# Altium schematic sheet MCU_Core.SchDoc
size A4; SheetNumber: 3; SheetTotal: 11
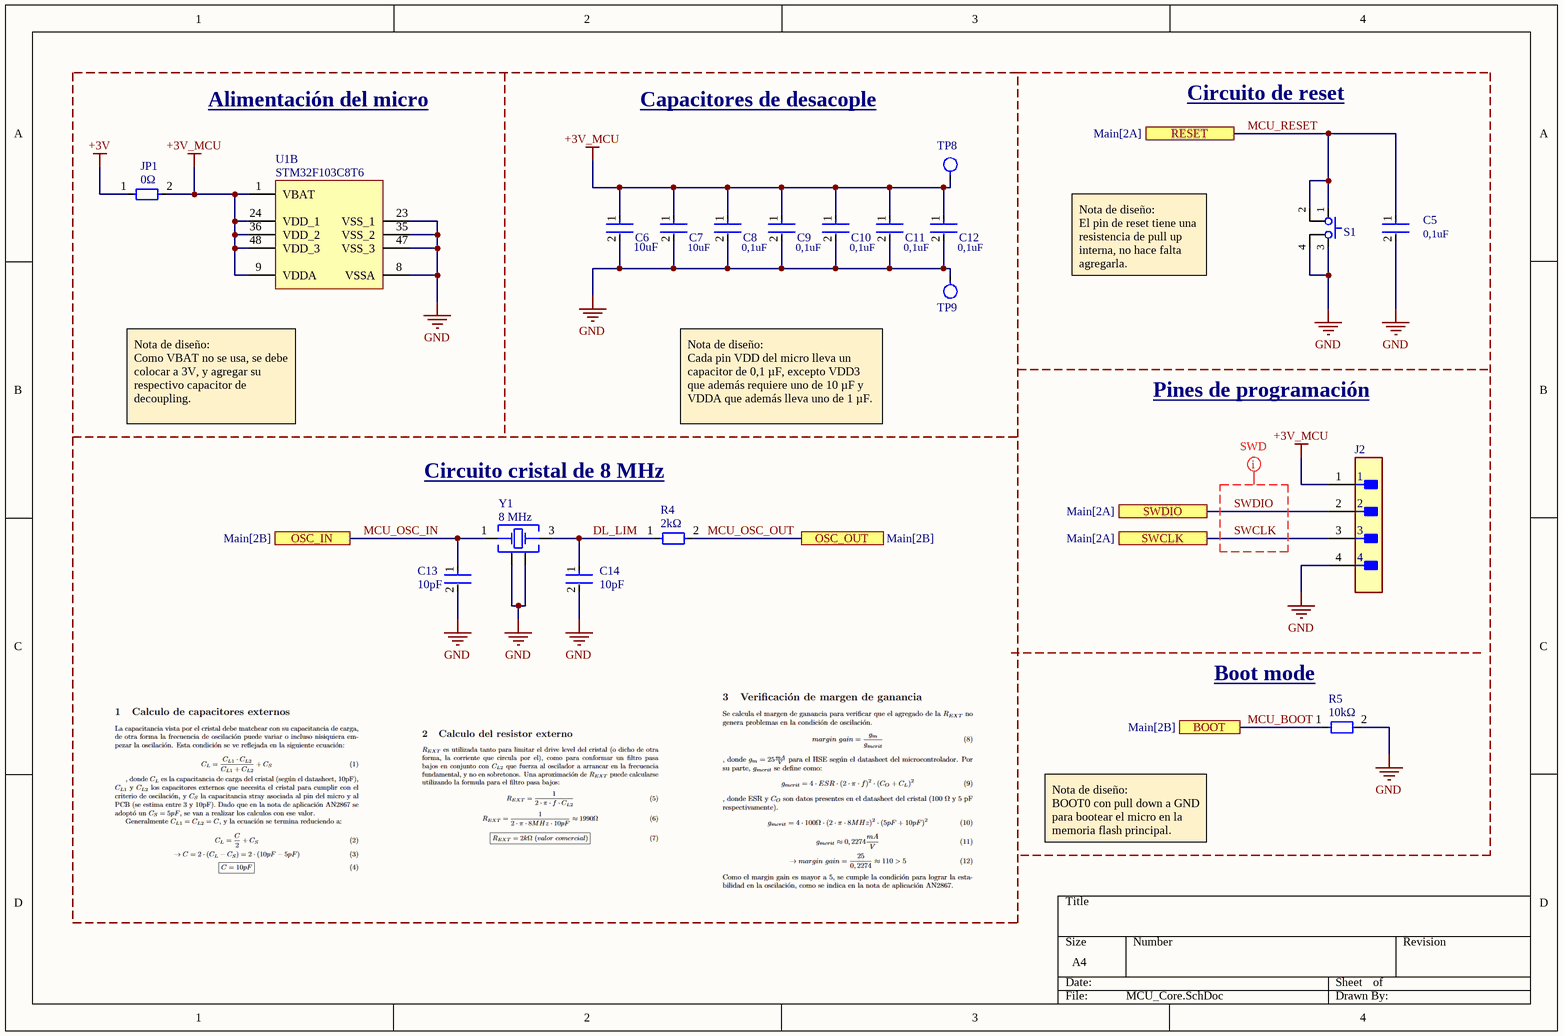
[diagram p0: MCU_Core.SchDoc]

## Parts
C5  Capacitance: 0,1uF  [CAP_0603]  (hidden comment: 0.1uF)
C6  10uF  [CAP_0603]
C7  10uF  [CAP_0603]
C8  Capacitance: 0,1uF  [CAP_0603]  (hidden comment: 0.1uF)
C9  Capacitance: 0,1uF  [CAP_0603]  (hidden comment: 0.1uF)
C10  Capacitance: 0,1uF  [CAP_0603]  (hidden comment: 0.1uF)
C11  Capacitance: 0,1uF  [CAP_0603]  (hidden comment: 0.1uF)
C12  Capacitance: 0,1uF  [CAP_0603]  (hidden comment: 0.1uF)
C13  10pF  [CAP_0603]
C14  10pF  [CAP_0603]
J2  HTSW-104-07-G-S  [FP-HTSW-104-07-G-S-MFG]  (value not drawn)
JP1  value 0Ω  [RES_0R_0603]  (hidden comment: Generic JP)  (no BOM)
R4  value 2kΩ  [RES_0603]  (hidden comment: 2k)
R5  value 10kΩ  [RES_0603]  (hidden comment: 10k)
S1  Tactile push button 5,2mm x 5,2mm  [Switch Tactile 5,2mm x 5,2mm]  (value not drawn)
TP8  Testpoint SMD  [Testpoint_SMD]  (value not drawn)  (no BOM)
TP9  Testpoint SMD  [Testpoint_SMD]  (value not drawn)  (no BOM)
U1  STM32F103C8T6  [STM-LQFP48_L]  (part B of 2)
Y1  Frequency: 8 MHz  [SMD5032-4P]  (hidden comment: Crystal SMD 4-P)

## Ports
BOOT (see Main[2B]), OSC_IN (see Main[2B]), OSC_OUT (see Main[2B]), RESET (see Main[2A]), SWCLK (see Main[2A]), SWDIO (see Main[2A])

## Nets
+3V: JP1.1
+3V_MCU: C6.1 C7.1 C8.1 C9.1 C10.1 C11.1 C12.1 J2.1 JP1.2 TP8.1 U1.1(VBAT) U1.9(VDDA) U1.24(VDD_1) U1.36(VDD_2) U1.48(VDD_3)
GND: C5.2 C6.2 C7.2 C8.2 C9.2 C10.2 C11.2 C12.2 C13.2 C14.2 J2.4 R5.2 S1.3 S1.4 TP9.1 U1.8(VSSA) U1.23(VSS_1) U1.35(VSS_2) U1.47(VSS_3) Y1.2(GND_&_Lid) Y1.4(GND_&_Lid)
DL_LIM: C14.1 R4.1 Y1.3(Crystal)
MCU_BOOT: R5.1 ; port BOOT
MCU_OSC_IN: C13.1 Y1.1(Crystal) ; port OSC_IN
MCU_OSC_OUT: R4.2 ; port OSC_OUT
MCU_RESET: C5.1 S1.1 S1.2 ; port RESET
SWCLK: J2.3 ; port SWCLK
SWDIO: J2.2 ; port SWDIO

## Layout directives
net class SWD: SWCLK, SWDIO

## Notes on the sheet
- Alimentación del micro
- Capacitores de desacople
- Circuito de reset
- Nota de diseño:
  El pin de reset tiene una resistencia de pull up interna, no hace falta agregarla.
- Nota de diseño:
  Como VBAT no se usa, se debe colocar a 3V, y agregar su respectivo capacitor de decoupling.
- Nota de diseño:
  Cada pin VDD del micro lleva un capacitor de 0,1 µF, excepto VDD3 que además requiere uno de 10 µF y VDDA que además lleva uno de 1 µF.
- Pines de programación
- Circuito cristal de 8 MHz
- (near R5) Boot mode
- Nota de diseño:
  BOOT0 con pull down a GND para bootear el micro en la memoria flash principal.

## Library data of the parts
C5 C8-C12 = Generic C: Cap 0.1 uF 10V X7R 0603; Dielectric: X5R; Tolerance: 10%; Case Code (Imperial): 0805; Mount: Surface Mount; Depth: 1.25mm; Length: 2mm; Lead Free: Lead Free; Packaging: Tape and Reel; Width: 0.049inch; Package Quantity: 1; Height: 1.25mm; Case/Package: 0805; Voltage Rating: 10V; Thickness: 0.053inch; Max Operating Temperature: 85°C; Case Code (Metric): 2012; Contact Plating: Tin; Min Operating Temperature: -55°C; Radiation Hardening: No; Voltage Rating (DC): 10V
C6 C7 = Generic C: Cap 10 uF 10V X7R 0603; Dielectric: X5R; Tolerance: 10%; Case Code (Imperial): 0805; Capacitance: 10uF; Mount: Surface Mount; Depth: 1.25mm; Length: 2mm; Lead Free: Lead Free; Packaging: Tape and Reel; Width: 0.049inch; Package Quantity: 1; Height: 1.25mm; Case/Package: 0805; Voltage Rating: 10V; Thickness: 0.053inch; Max Operating Temperature: 85°C; Case Code (Metric): 2012; Contact Plating: Tin; Min Operating Temperature: -55°C; Radiation Hardening: No; Voltage Rating (DC): 10V
C13 C14 = Generic C: Cap 10 pF 10V X7R 0603; Dielectric: X5R; Tolerance: 10%; Case Code (Imperial): 0805; Capacitance: 10pF; Mount: Surface Mount; Depth: 1.25mm; Length: 2mm; Lead Free: Lead Free; Packaging: Tape and Reel; Width: 0.049inch; Package Quantity: 1; Height: 1.25mm; Case/Package: 0805; Voltage Rating: 10V; Thickness: 0.053inch; Max Operating Temperature: 85°C; Case Code (Metric): 2012; Contact Plating: Tin; Min Operating Temperature: -55°C; Radiation Hardening: No; Voltage Rating (DC): 10V
J2 = CMP-02766-001776-1: CONN HEADER VERT 4POS 2.54MM; Gender: Male; Number of Contacts: 4; Packaging: Bulk; RoHS Compliant: Yes; Number of Rows: 1; Mount: Through Hole; Contact Material: Bronze; Series: HTSW; Radiation Hardening: No; Pitch: 2.54mm; Reach SVHC Compliant: Yes; Contact Plating: Gold; Termination: Through Hole
JP1 = Generic JP: Generic Jumper
R4 = Generic R: RES  2k 1% 0603
R5 = Generic R: RES  10k 1% 0603
S1 = Tactile push button 5,2mm x 5,2mm: Switch Tactile SPST-NO 5,2mm x 5,2mm
TP8 TP9 = Testpoint_SMD: Testpoint SMD de 1mm de diametro.
U1 = STM32F103C8T6: ARM Cortex-M3 32-bit MCU, 64 KB Flash, 20 KB Internal RAM, 37 I/Os, 48-pin LQFP, -40 to 85 degC, Tray; Supply Voltage(Vcc) min (V): 2; Internal RAM Size (kB): 20; FLASH Size (Prog) (kB): 64; A/D Converter: 2x12-bit (10 Channel); I/Os (High Current): 37; Operating Frequency(F) (Processor speed) (MHz): 72; Core: ARM Cortex-M3; ComponentLink3Description: Package Specification; Mounting Technology: Surface Mount; PartNumber: STM32F103C8T6; PackageReference: LQFP48; Packing: Tray; ComponentLink3URL: http://www.st.com/st-web-ui/static/active/en/resource/technical/document/datasheet/DM00058181.pdf; DatasheetVersion: Rev. 16; ComponentLink1URL: http://www.st.com/web/en/home.html; PackageVersion: Rev. 6, 06/2013; ComponentLink2URL: http://www.st.com/st-web-ui/static/active/en/resource/technical/document/datasheet/CD00161566.pdf; ComponentLink1Description: Manufacturer URL; ComponentLink2Description: Datasheet; PackageDescription: 48-Pin Low Profile Quad Flat Package, 7 x 7 mm Body, 0.5 mm Pitch
Y1 = Crystal SMD 4-P: Cristal SMD 4-P 8 MHz; Manufacturer part: SX5B8.000F1020F30; Manufacturer: Shenzhen SCTF Elec; CL: 10 pF; ESR: 100 Ω; Datasheet: https://jlcpcb.com/api/file/downloadByFileSystemAccessId/8590208237112238080; Package: SMD5032-4P